# Altium schematic sheet 3-PWR_BAK_BATT.SCHDOC
size A4
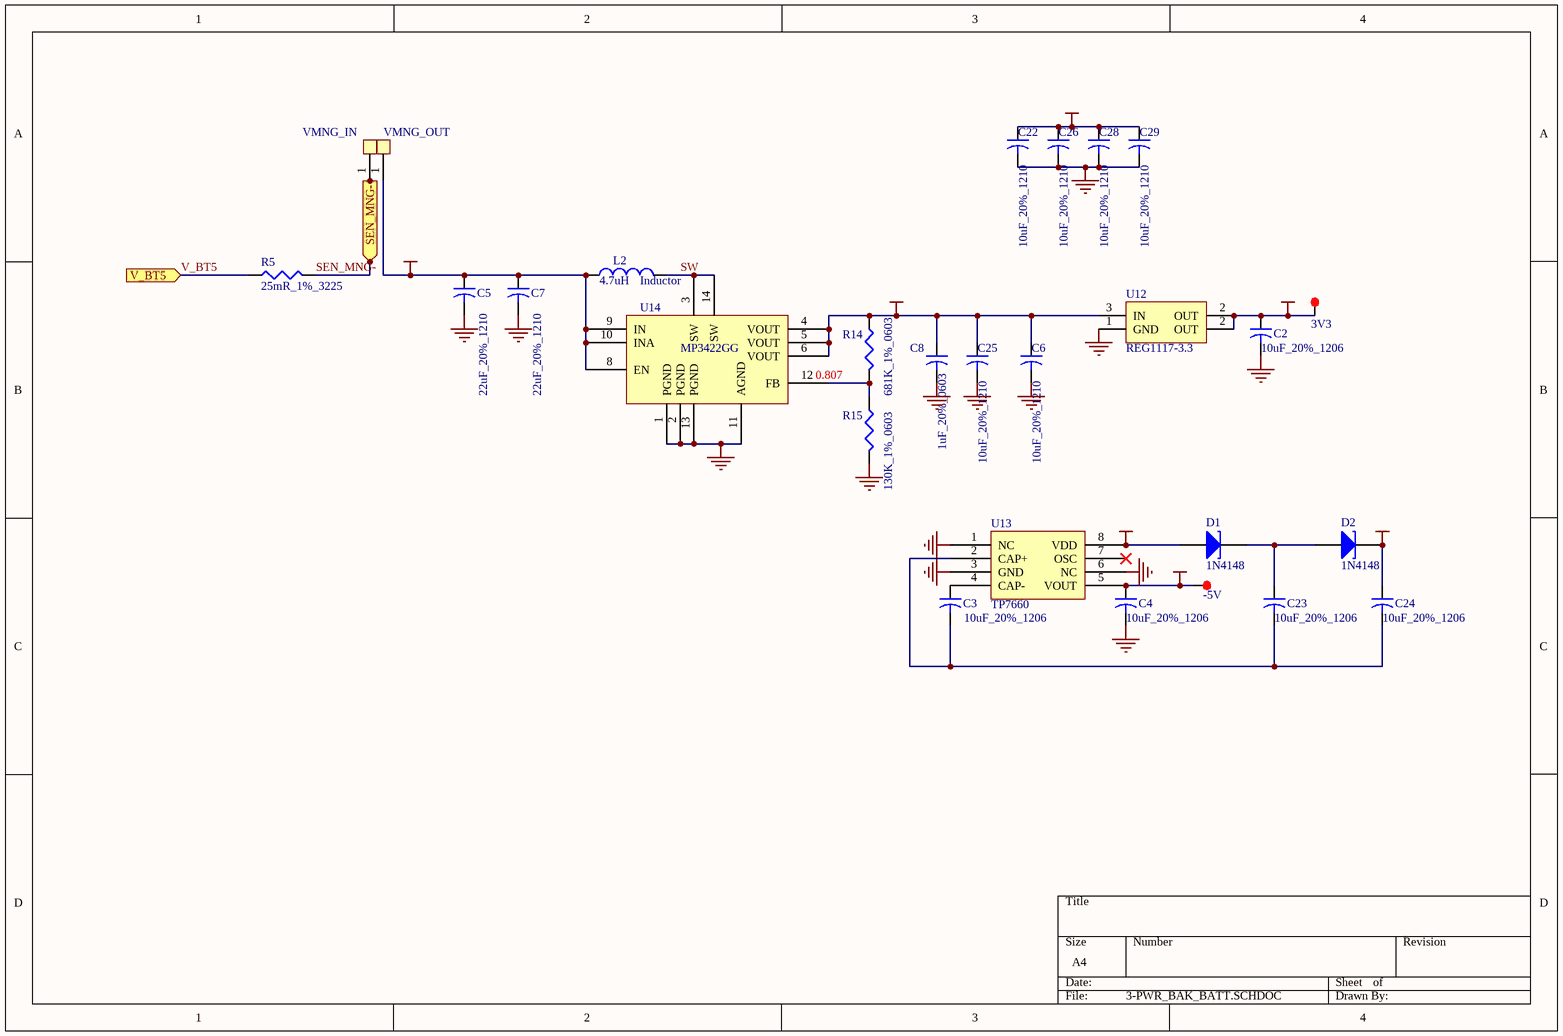
[diagram p0: 3-PWR_BAK_BATT.SCHDOC]

## Parts
3V3  TP  [TP_1MM]  (value not drawn)
-5V  TP  [TP_1MM]  (value not drawn)
C2  10uF_20%_1206  [CC3216-1206]
C3  10uF_20%_1206  [CC3216-1206]
C4  10uF_20%_1206  [CC3216-1206]
C5  22uF_20%_1210  [CC3225-1210]
C6  10uF_20%_1210  [CC3225-1210]
C7  22uF_20%_1210  [CC3225-1210]
C8  1uF_20%_0603  [C1608-0603]
C22  10uF_20%_1210  [CC3225-1210]
C23  10uF_20%_1206  [CC3216-1206]
C24  10uF_20%_1206  [CC3216-1206]
C25  10uF_20%_1210  [CC3225-1210]
C26  10uF_20%_1210  [CC3225-1210]
C28  10uF_20%_1210  [CC3225-1210]
C29  10uF_20%_1210  [CC3225-1210]
D1  1N4148  [LED0805]
D2  1N4148  [LED0805]
L2  Inductor  value 4.7uH  [L6x6x3_3A]
R5  25mR_1%_3225  [CR6332-2512]
R14  681K_1%_0603  [C1608-0603]
R15  130K_1%_0603  [C1608-0603]
U12  REG1117-3.3  [SOT223]
U13  TP7660  [SO-8]
U14  MP3422GG  [QFN-14]
VMNG_IN  ND  [END_3_6]  (value not drawn)
VMNG_OUT  ND  [END_3_6]  (value not drawn)

## Ports
SEN_MNG- (out), V_BT5 (in)

## Nets
GND: C2.2 C4.2 C5.2 C6.2 C7.2 C8.2 C22.2 C25.2 C26.2 C28.2 C29.2 R15.2 U12.1(GND) U13.1(NC) U13.3(GND) U13.6(NC) U14.1(PGND) U14.2(PGND) U14.11(AGND) U14.13(PGND)
VCC_3V3: 3V3.1(TP) C2.1 U12.2(OUT)
VCC_5V: C6.1 C8.1 C22.1 C25.1 C26.1 C28.1 C29.1 D1.1(A) R14.1 U12.3(IN) U13.8(VDD) U14.4(VOUT) U14.5(VOUT) U14.6(VOUT)
VCC_9V: C24.1 D2.2(K)
VCC_-5V: -5V.1(TP) C4.1 U13.5(VOUT)
VCC_MNG: C5.1 C7.1 L2.1 U14.8(EN) U14.9(IN) U14.10(INA) VMNG_OUT.1(SW)
SEN_MNG-: R5.2 VMNG_IN.1(SW) ; port SEN_MNG-
SW: L2.2 U14.3(SW) U14.14(SW)
V_BT5: R5.1 ; port V_BT5
NetC3_1: C3.1 U13.4(CAP-)
NetC3_2: C3.2 C23.2 C24.2 U13.2(CAP+)
NetC23_1: C23.1 D1.2(K) D2.1(A)
NetR14_2: R14.2 R15.1 U14.12(FB)

Not connected (* = marked no-connect by the designer): U13 7(OSC)*

## Notes on the sheet
- 0.807

## Library data of the parts
3V3 -5V = TP_1mm
C2-C4 C23 C24 = Cap2: Capacitor; Value: 10uF; Published: 23-Sep-2002; Publisher: Altium Limited
C5-C8 C22 C25 C26 C28 C29 = Cap2: Capacitor; Value: 0.1uF 20% 0603; Published: 23-Sep-2002; Publisher: Altium Limited
D1 D2 = D Tunnel1: Tunnel Diode - RLC Model; Published: 8-Jun-2000; LatestRevisionDate: 17-Jul-2002; LatestRevisionNote: Re-released for DXP Platform.; Publisher: Altium Limited
R5 = Res3: Resistor; Value: 150R %5 0603; Published: 8-Jun-2000; Revision: July-2002: Re-released for DXP Platform.; Publisher: Altium Limited
R14 R15 = Res3: Resistor; Value: 1K%5 0603; Published: 8-Jun-2000; Revision: July-2002: Re-released for DXP Platform.; Publisher: Altium Limited
U12 = REG1117-5: Positive Regulator; Package Information: Latest Revision: revC; Published: 8-Jun-2000; Revision: 17-Jul-2002: Re-released for DXP Platform.; Datasheet: Latest Revision: Sep-1997; Package Reference: ZZ311; Publisher: Altium Limited
U14 = MP3422
L2 = Inductor: Published: 8-Jun-2000; Revision: July-2002: Re-released for DXP Platform.; Publisher: Altium Limited